# Altium schematic sheet Simon_game.SchDoc
size A4; SheetNumber: 1; SheetTotal: 3
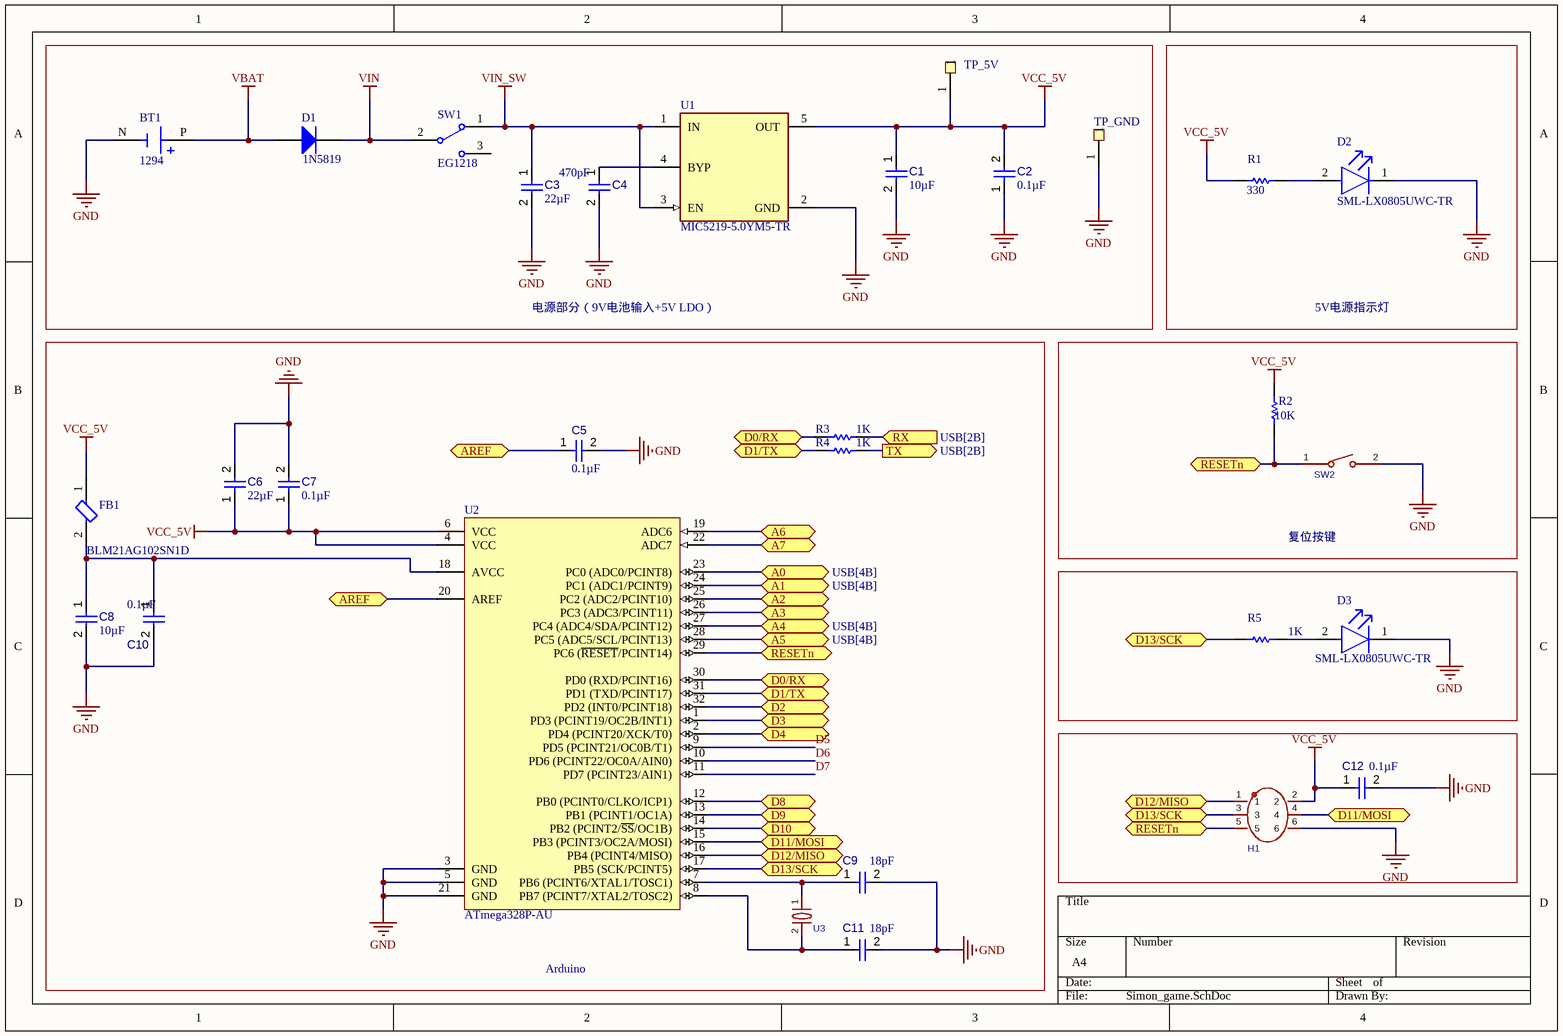
[diagram p0: Simon_game.SchDoc]

## Parts
BT1  1294  [BAT_1294]
C1  value 10µF  [CAPC2013X135X45NL10T25]  (hidden comment: Capacitor 10 uF +/- 10% 16 V 0805)
C2  value 0.1µF  [CAPC2013X135X45NL10T25]  (hidden comment: Capacitor 10 uF +/- 10% 16 V 0805)
C3  value 22µF  [CAPC2013X135X45NL10T25]  (hidden comment: Capacitor 10 uF +/- 10% 16 V 0805)
C4  value 470pF  [CAPC2013X135X45NL10T25]  (hidden comment: Capacitor 10 uF +/- 10% 16 V 0805)
C5  value 0.1µF  [CAPC2013X135X45NL10T25]  (hidden comment: Capacitor 10 uF +/- 10% 16 V 0805)
C6  value 22µF  [CAPC2013X135X45NL10T25]  (hidden comment: Capacitor 10 uF +/- 10% 16 V 0805)
C7  value 0.1µF  [CAPC2013X135X45NL10T25]  (hidden comment: Capacitor 10 uF +/- 10% 16 V 0805)
C8  value 10µF  [CAPC2013X135X45NL10T25]  (hidden comment: Capacitor 10 uF +/- 10% 16 V 0805)
C9  value 18pF  [CAPC2013X135X45NL10T25]  (hidden comment: Capacitor 10 uF +/- 10% 16 V 0805)
C10  value 0.1µF  [CAPC2013X135X45NL10T25]  (hidden comment: Capacitor 10 uF +/- 10% 16 V 0805)
C11  value 18pF  [CAPC2013X135X45NL10T25]  (hidden comment: Capacitor 10 uF +/- 10% 16 V 0805)
C12  value 0.1µF  [CAPC2013X135X45NL10T25]  (hidden comment: Capacitor 10 uF +/- 10% 16 V 0805)
D1  1N5819  [ONSC-AXIAL_LEAD-2-59-10_P]
D2  SML-LX0805UWC-TR  [FP-SML-LX0805UWC-TR-MFG]
D3  SML-LX0805UWC-TR  [FP-SML-LX0805UWC-TR-MFG]
FB1  BLM21AG102SN1D  [FP-BLM21-0_2-t0_85-e0_5-MFG]
H1  PM2.54-2*3  [HDR-TH_6P-P2.54-V-F-R2-C3-S2.54]  (value not drawn)
R1  value 330  [RESC2013X50X35ML15T15]  (hidden comment: Resistor 0R +/- 1% 0805 125 mW)
R2  value 10K  [RESC2013X50X35ML15T15]  (hidden comment: Resistor 0R +/- 1% 0805 125 mW)
R3  value 1K  [RESC2013X50X35ML15T15]  (hidden comment: Resistor 0R +/- 1% 0805 125 mW)
R4  value 1K  [RESC2013X50X35ML15T15]  (hidden comment: Resistor 0R +/- 1% 0805 125 mW)
R5  value 1K  [RESC2013X50X35ML15T15]  (hidden comment: Resistor 0R +/- 1% 0805 125 mW)
SW1  EG1218  [ESWI-EG1218_V]
SW2  TS-1088-AR02016  [SW-SMD_L3.9-W3.0-P4.45]  (value not drawn)
TP_5V  TP_5V  [PCBComponent_1]  (value not drawn)
TP_GND  Component_1  [PCBComponent_1]  (value not drawn)
U1  MIC5219-5.0YM5-TR  [FP-SOT23-5LD-PL-1-MFG]
U2  ATmega328P-AU  [32A_M]
U3  ABLS-12.000MHZ-B4H-T  [CRYSTAL-SMD_L11.4-W4.7-LS12.7]  (value not drawn)

## Blocks framed on the sheet
电源部分（9V电池输入+5V LDO）: BT1 C1-C4 D1 SW1 TP_5V TP_GND U1
5V电源指示灯: D2 R1
Arduino: C5-C11 FB1 R3 R4 U2 U3
复位按键: R2 SW2

## Ports
A0 (bidir, see USB[4B]), A1 (bidir, see USB[4B]), A2 (bidir, see buttons_audio_amplifier[3A], USB[4B]), A3 (bidir, see buttons_audio_amplifier[3A], USB[4B]), A4 (bidir, see USB[4B]), A5 (bidir, see USB[4B]), A6 (bidir, see buttons_audio_amplifier[3B], USB[4B]), A7 (bidir, see buttons_audio_amplifier[3B], USB[4B]), AREF (bidir, see Simon_game[1C], USB[4B]), AREF (bidir, see Simon_game[2B], USB[4B]), D0/RX (bidir, see Simon_game[2B], USB[4C]), D0/RX (bidir, see Simon_game[2C], USB[4C]), D1/TX (bidir, see Simon_game[2B], USB[4C]), D1/TX (bidir, see Simon_game[2C], USB[4C]), D2 (bidir, see USB[4C]), D3 (bidir, see USB[4C]), D4 (bidir, see USB[4C]), D8 (bidir, see buttons_audio_amplifier[4C], USB[4C]), D9 (bidir, see buttons_audio_amplifier[1C], USB[4C]), D10 (bidir, see USB[4C]), D11/MOSI (bidir, see Simon_game[2D], USB[4C]), D11/MOSI (bidir, see Simon_game[4D], USB[4C]), D12/MISO (bidir, see Simon_game[2D], USB[4C]), D12/MISO (bidir, see Simon_game[3D], USB[4C]), D13/SCK (bidir, see Simon_game[2D], Simon_game[3C], USB[4B]), D13/SCK (bidir, see Simon_game[2D], Simon_game[3D], USB[4B]), D13/SCK (bidir, see Simon_game[3C], Simon_game[3D], USB[4B]), RESETn (bidir, see Simon_game[2C], Simon_game[3D], USB[2B], USB[4B], USB[4C]), RESETn (bidir, see Simon_game[2C], Simon_game[4B], USB[2B], USB[4B], USB[4C]), RESETn (bidir, see Simon_game[3D], Simon_game[4B], USB[2B], USB[4B], USB[4C]), RX (in, see USB[2B]), TX (out, see USB[2B])

## Nets
GND: BT1.N(NEG) C1.2 C2.1 C3.2 C4.2 C5.2 C6.2 C7.2 C8.2 C9.2 C10.2 C11.2 C12.2 D2.1(C) D3.1(C) H1.6 SW2.2 TP_GND.1 U1.2(GND) U2.3(GND) U2.5(GND) U2.21(GND)
VBAT: BT1.P(POS) D1.1(A)
VCC_5V: C1.1 C2.2 C6.1 C7.1 C12.1 FB1.1 H1.2 R1.1 R2.2 TP_5V.1 U1.5(OUT) U2.4(VCC) U2.6(VCC)
VIN: D1.2(K) SW1.2(COM)
VIN_SW: C3.1 SW1.1 U1.1(IN) U1.3(EN)
A0: U2.23(PC0_(ADC0/PCINT8)) ; port A0
A1: U2.24(PC1_(ADC1/PCINT9)) ; port A1
A2: U2.25(PC2_(ADC2/PCINT10)) ; port A2
A3: U2.26(PC3_(ADC3/PCINT11)) ; port A3
A4: U2.27(PC4_(ADC4/SDA/PCINT12)) ; port A4
A5: U2.28(PC5_(ADC5/SCL/PCINT13)) ; port A5
A6: U2.19(ADC6) ; port A6
A7: U2.22(ADC7) ; port A7
AREF: C5.1 U2.20(AREF) ; port AREF
D0/RX: R3.1 U2.30(PD0_(RXD/PCINT16)) ; port D0/RX
D1/TX: R4.1 U2.31(PD1_(TXD/PCINT17)) ; port D1/TX
D2: U2.32(PD2_(INT0/PCINT18)) ; port D2
D3: U2.1(PD3_(PCINT19/OC2B/INT1)) ; port D3
D4: U2.2(PD4_(PCINT20/XCK/T0)) ; port D4
D5: U2.9(PD5_(PCINT21/OC0B/T1))
D6: U2.10(PD6_(PCINT22/OC0A/AIN0))
D7: U2.11(PD7_(PCINT23/AIN1))
D8: U2.12(PB0_(PCINT0/CLKO/ICP1)) ; port D8
D9: U2.13(PB1_(PCINT1/OC1A)) ; port D9
D10: U2.14(PB2_(PCINT2/~{SS}/OC1B)) ; port D10
D11/MOSI: H1.4 U2.15(PB3_(PCINT3/OC2A/MOSI)) ; port D11/MOSI
D12/MISO: H1.1 U2.16(PB4_(PCINT4/MISO)) ; port D12/MISO
D13/SCK: H1.3 R5.1 U2.17(PB5_(SCK/PCINT5)) ; port D13/SCK
RESETn: H1.5 R2.1 SW2.1 U2.29(PC6_(~{RESET}/PCINT14)) ; port RESETn
RX: R3.2 ; port RX
TX: R4.2 ; port TX
NetC4_1: C4.1 U1.4(BYP)
NetC8_1: C8.1 C10.1 FB1.2 U2.18(AVCC)
NetC9_1: C9.1 U2.7(PB6_(PCINT6/XTAL1/TOSC1)) U3.1
NetC11_1: C11.1 U2.8(PB7_(PCINT7/XTAL2/TOSC2)) U3.2(GND)
NetD2_2: D2.2(A) R1.2
NetD3_2: D3.2(A) R5.2

Not connected (* = marked no-connect by the designer): SW1 3

## Library data of the parts
BT1 = 1294: 9 Volt Battery Holder- PC Terminals; MF: Keystone Electronics; SnapEDA_Link: https://www.snapeda.com/parts/1294/Keystone/view-part/?ref=snap; Package: NON STANDARD-6 Keystone; Value: *; MP: 1294; Check_prices: https://www.snapeda.com/parts/1294/Keystone/view-part/?ref=eda
C1-C12 = CMP-001-00015-6: Chip Capacitor, 10 uF, +/- 10%, 16 V, 0805 (2012 Metric); Voltage Rating: 16V; Capacitor Type: Ceramic; RoHS Compliant: True; Max Operating Temperature: 85°C; Min Operating Temperature: -55°C; Mounting Technology: SM; Tolerance: 10%; Case/Package: 0805; Pins: 2
D1 = CMP-004-00009-2: Low Drop Power Schottky Rectifier, 40 V, 1 A, 2-Pin DO-41, RoHS; Manufacturer: ON Semiconductor; Max Surge Current: 25A; Forward Current: 1A; Package Version: Rev. U, 02/2005; Peak Reverse Current: 1mA; Max Operating Temperature: 125°C; Case/Package: DO; Package URL: http://www.onsemi.cn/pub_link/Collateral/59-10.PDF; Packaging: Bulk; Manufacturer URL: http://www.onsemi.com/; Min Operating Temperature: -65°C; Package Description: 2-Pin, Axial Lead, Diameter 2.35 mm; Mounting Technology: TH; Datasheet URL: http://www.onsemi.cn/pub_link/Collateral/1N5817-D.PDF; Datasheet Version: Rev. 10, 07/2006; Package Reference: AXIAL_LEAD-2-59-10; Pins: 2; RoHS Compliant: True
D2 D3 = CMP-00229-00139794-1: SML-LX0805UWC-TR White LED, 0805 Diffused, Rectangle Lens SMD package; NexarPartId: 139794; Approvals: CSA, UL; Lens Color: Clear, Yellow; Luminous Intensity: 150mcd; Power Rating: 120mW; Forward Current: 20mA; Forward Voltage: 3.5V; Number of LEDs: 1; Viewing Angle: 120°; RoHS: Compliant; Case/Package: 0805; Illumination Color: White; Min Operating Temperature: -40°C; Mount: Surface Mount; Max Operating Temperature: 85°C
FB1 = CMP-0686-00665-3: Chip Ferrite Bead, 0805, 1000Ω @ 100MHz, 0.27Ω, 25%, 600mA; Material: Steel; Number of Lines: 1; Current Rating: 500mA; Max DC Current: 200mA; Impedance: 1kR; DC Resistance (DCR): 280mR; Shielding: Unshielded; Length: 2mm; Max Current Rating: 600mA; Max Operating Temperature: 125°C; Lead Free: Lead Free; Test Frequency: 100MHz; Number of Pins: 2; Height: 0.85mm; Package Quantity: 1; Termination: SMD/SMT; Depth: 1.25mm; Radiation Hardening: No; Case Code (Metric): 2012; Tolerance: 25%; Core Material: Ferrite; Min Operating Temperature: -55°C; Case Code (Imperial): 0805; Weight: 0.000194oz; DC Current: 200mA; Case/Package: 0805; REACH SVHC: No SVHC; Frequency: 100MHz; Military Standard: Not; Number of Circuits: 1; Width: 1.25mm; Packaging: Tape and Reel
R1-R5 = CMP-009-00001-5: Chip Resistor, 0 Ohm, +/- 1%, 125 mW, -55 to 155 degC, 0805 (2012 Metric); Voltage Rating: 150V; Power: 125mW; Mounting Technology: SM; Max Operating Temperature: 155°C; Case/Package: 0805; RoHS Compliant: True; Pins: 2; Min Operating Temperature: -55°C; Tolerance: 1%
SW1 = CMP-1696-00002-1: Slide Switch, 500 V, -20 to 70 degC, 3-Pin THD, RoHS; Case\Package: SOT-23-5; Output Current: 150 mA; Nominal Output Voltage: 3.3 V; Max Power Dissipation: 250 mW; Min Input Voltage: 4.3 V; Outputs: 1; Max Input Voltage: 8 V; Dropout Voltage: 300 mV; PackageDescription: 3-Pin Through Hole Device, Body 11.6 x 4 mm, Pitch 2.5 mm; ComponentLink1URL: http://www.e-switch.ch/en/; RoHSCompliant: true; Length: 3 mm; ComponentLink1Description: Manufacturer URL; Power Rating: 250 mW; Mount: Surface Mount; Max Operating Temperature: 85 degC; REACH SVHC: No SVHC; Radiation Hardening: No; Height: 1.3 mm; Pins: 5; Max Ouput Current: 150 mA; Output Voltage: 3.3 V; Width: 1.8 mm; Package Quantity: 3000; ComponentLink2URL: https://www.e-switch.com/system/asset/product_line/data_sheet/119/EG.pdf; Min Operating Temperature: -40 degC; ComponentLink2Description: Datasheet; DatasheetVersion: Oct-15; PackageReference: EG1218; Packaging: Tape and Reel
TP_5V = Component_1
U1 = CMP-06324-000019-1: IC REG LINEAR 5V 500MA SOT23-5; Manufacturer: Microchip Technology; Number Of Outputs: 1; Accuracy Percentage: 1%; Min Supply Voltage: 2.5V; Dropout Voltage: 350mV; Nominal Supply Current: 80-12000uA; Standoff Height: 0mm; Max Junction Temp: +125°C; Output Type: Fixed; Max Supply Voltage: 12V; ComponentLink2Description: Datasheet; Manufacturer Part Number: MIC5219-5.0YM5-TR; Category: IC; Height: 1.45mm; Temperature: -40°C to +125°C; Device Class L1: Integrated Circuits (ICs); Device Class L3: Voltage Regulators - Linear; Octopart: https://octopart.com/mic5219-5.0ym5-tr-microchip-66802269; Output Current: 500mA; Temperature Range Low: -40°C; Lead Free: Yes; Package: SOT23-5LD-PL-1; Automotive: No; Ambient Temperature Range High: +125°C; ComponentLink2URL: http://ww1.microchip.com/downloads/en/DeviceDoc/MIC5219-500mA-Peak-Output-LDO-Regulator-DS20006021A.pdf; Output Voltage: 5V; Temperature Range High: +125°C; Digikey Description: IC REG LINEAR 5V 500MA SOT23-5; Ambient Temperature Range Low: -40°C; RoHS: TRUE; Mouser Description: IC REG LINEAR 5V 500MA SOT23-5; Device Class L2: Power Management ICs
U2 = CMP-0095-00269-2: 8-bit AVR Microcontroller, 32KB Flash, 1KB EEPROM, 2KB SRAM, 32-pin TQFP, Industrial Grade (-40°C to 85°C); PackageDescription: 32-Lead, 7x7x1.0 mm Body, 0.8mm Lead Pitch, Thin Profile Plastic Quad Flat Package (TQFP); DatasheetVersion: revD, May-2011; RevisionNote: DatasheetVersion & PackageVersion updated. URLs added.; ComponentLink1URL: http://www.atmel.com/; ComponentLink2Description: ATmega48A/48PA/88A/88PA/168A/168PA/328/328P Datasheet; Code_JEDEC: MS-026-ABA; ComponentLink1Description: Manufacturer URL; PackageReference: 32A; ComponentLink3Description: ATmega48A/48PA/88A/88PA/168A/168PA/328/328P Summary; ComponentLink2URL: http://www.atmel.com/dyn/resources/prod_documents/doc8271.pdf; PackageVersion: revC, Oct-2010; ComponentLink3URL: http://www.atmel.com/dyn/resources/prod_documents/8271S.pdf
H1 = PM2.54-2*3: Symbol: PM2.54-2*3
SW2 = TS-1088-AR02016: Symbol: TS-1088-AR02016
U3 = ABLS-12.000MHZ-B4H-T: Symbol: ABLS-12.000MHZ-B4H-T